# EAGLE design clock_kit (EAGLE 5.11)
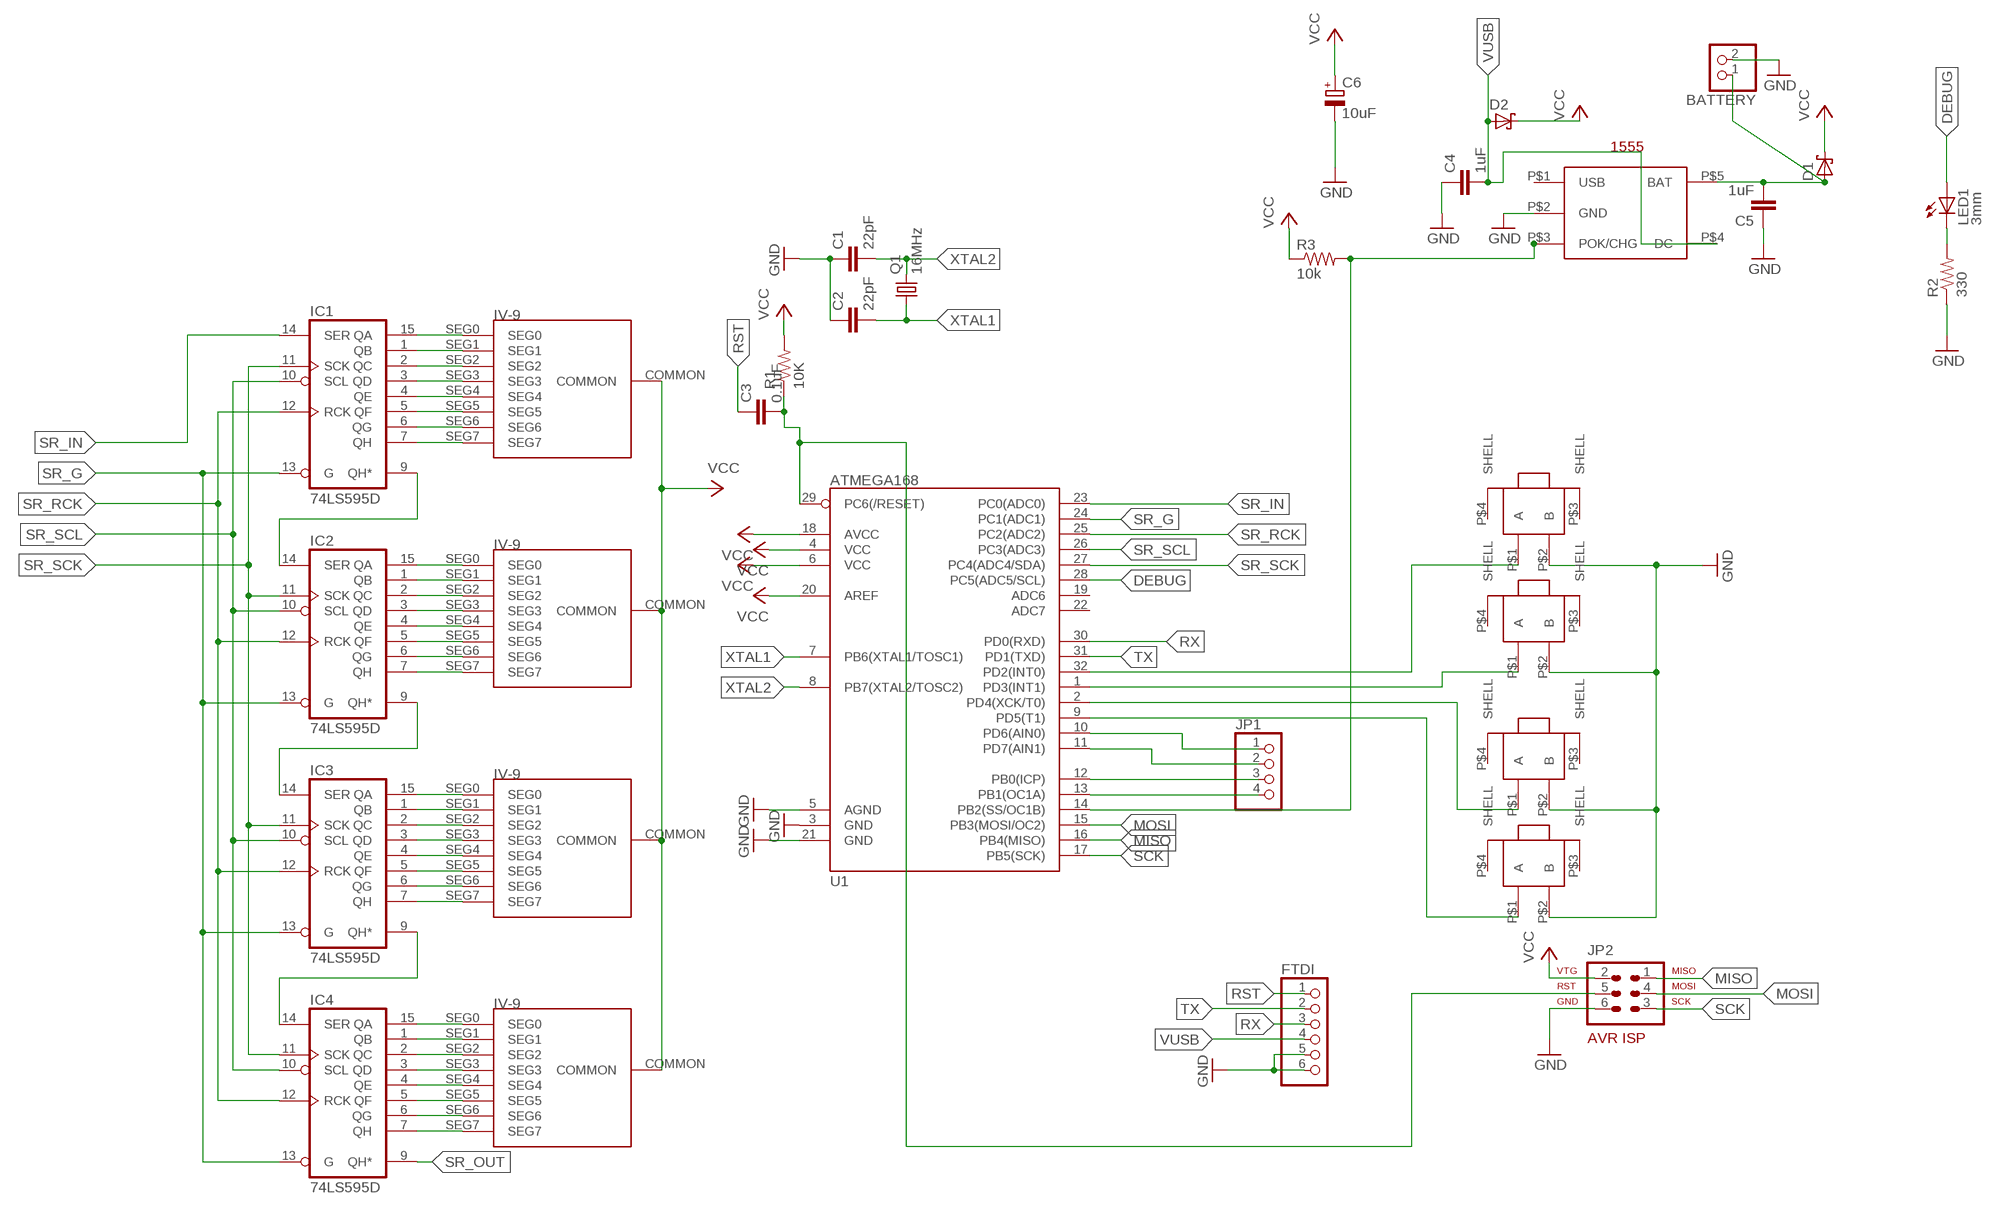
[diagram p0: schematic, sheet 1]

## Parts
BATTERY  PINHD-1X2  [1X02]
C1  22pF  C-EUC1206  [C1206]
C2  22pF  C-EUC1206  [C1206]
C3  0.1uF  C-EUC1206  [C1206]
C4  1uF  C-EUC1206  [C1206]
C5  1uF  C-EUC1206  [C1206]
C6  10uF  CPOL-EUE/7260-38W  [E/7260-38W]
D1  SCHOTTKY-DIODESMD  [SMB]
D2  SCHOTTKY-DIODESMD  [SMB]
FTDI  PINHEAD_PINHD-1X6  [PINHEAD_1X06]
IC1  74LS595D  [SO16]
IC2  74LS595D  [SO16]
IC3  74LS595D  [SO16]
IC4  74LS595D  [SO16]
JP1  PINHD-1X4  [1X04]
JP2  AVR-ISP-6  [AVR-ISP-6]
LED1  3mm  LEDCHIPLED_0805  [CHIPLED_0805]
Q1  16MHz  CRYSTALHC49S  [HC49/S]
R1  10K  R-US_R1206  [R1206]
R2  330  R-US_M1206  [M1206]
R3  10k  R-US_M1206  [M1206]
U1  ATMEGA168  [TQFP32-08]
U$1  DISPLAY_TUBES_IV-9MODIFIED  [DISPLAY_TUBES_IV-9_MODIFIED]
U$2  DISPLAY_TUBES_IV-9MODIFIED  [DISPLAY_TUBES_IV-9_MODIFIED]
U$3  DISPLAY_TUBES_IV-9MODIFIED  [DISPLAY_TUBES_IV-9_MODIFIED]
U$4  MAX1555  [SOT23-5]
U$5  DISPLAY_TUBES_IV-9MODIFIED  [DISPLAY_TUBES_IV-9_MODIFIED]
U$6  SWITCH_TACT_THRUHOLETHRUHOLE  [TACT_SWITCH_THRU_HOLE]
U$7  SWITCH_TACT_THRUHOLETHRUHOLE  [TACT_SWITCH_THRU_HOLE]
U$8  SWITCH_TACT_THRUHOLETHRUHOLE  [TACT_SWITCH_THRU_HOLE]
U$9  SWITCH_TACT_THRUHOLETHRUHOLE  [TACT_SWITCH_THRU_HOLE]

## Nets
DEBUG: LED1.A U1.28(PC5(ADC5/SCL))
GND [power]: BATTERY.2 C1.1 C2.1 C4.1 C5.1 C6.- FTDI.5 FTDI.6 JP2.6 R2.1 U1.3(GND) U1.5(AGND) U1.21(GND) U$4.P$2(GND) U$6.P$2(B) U$7.P$2(B) U$8.P$2(B) U$9.P$2(B)
MISO: JP2.1 U1.16(PB4(MISO))
MOSI: JP2.4 U1.15(PB3(MOSI/OC2))
N$1: IC1.15(QA) U$5.SEG0
N$2: IC1.1(QB) U$5.SEG1
N$3: IC1.2(QC) U$5.SEG2
N$4: IC1.3(QD) U$5.SEG3
N$5: IC1.4(QE) U$5.SEG4
N$6: IC1.5(QF) U$5.SEG5
N$7: IC1.6(QG) U$5.SEG6
N$8: IC1.7(QH) U$5.SEG7
N$9: IC2.15(QA) U$1.SEG0
N$10: IC2.1(QB) U$1.SEG1
N$11: IC2.2(QC) U$1.SEG2
N$12: IC2.3(QD) U$1.SEG3
N$13: IC2.4(QE) U$1.SEG4
N$14: IC2.5(QF) U$1.SEG5
N$15: IC2.6(QG) U$1.SEG6
N$16: IC2.7(QH) U$1.SEG7
N$17: IC3.15(QA) U$2.SEG0
N$18: IC3.1(QB) U$2.SEG1
N$19: IC3.2(QC) U$2.SEG2
N$20: IC3.3(QD) U$2.SEG3
N$21: IC3.4(QE) U$2.SEG4
N$22: IC3.5(QF) U$2.SEG5
N$23: IC3.6(QG) U$2.SEG6
N$24: IC3.7(QH) U$2.SEG7
N$25: IC4.15(QA) U$3.SEG0
N$26: IC4.1(QB) U$3.SEG1
N$27: IC4.2(QC) U$3.SEG2
N$28: IC4.3(QD) U$3.SEG3
N$29: IC4.4(QE) U$3.SEG4
N$30: IC4.5(QF) U$3.SEG5
N$31: IC4.6(QG) U$3.SEG6
N$32: IC4.7(QH) U$3.SEG7
N$33: IC1.9(QH*) IC2.14(SER)
N$34: IC2.9(QH*) IC3.14(SER)
N$35: IC3.9(QH*) IC4.14(SER)
N$36: R3.2 U1.14(PB2(SS/OC1B)) U$4.P$3(POK/CHG)
N$39: LED1.C R2.2
N$40: C3.2 JP2.5 R1.1 U1.29(PC6(/RESET))
N$41: U1.32(PD2(INT0)) U$6.P$1(A)
N$42: U1.1(PD3(INT1)) U$7.P$1(A)
N$43: U1.2(PD4(XCK/T0)) U$8.P$1(A)
N$44: U1.9(PD5(T1)) U$9.P$1(A)
N$45: BATTERY.1 C5.2 D1.A U$4.P$5(BAT)
N$46: JP1.4 U1.13(PB1(OC1A))
N$47: JP1.3 U1.12(PB0(ICP))
N$48: JP1.2 U1.11(PD7(AIN1))
N$49: JP1.1 U1.10(PD6(AIN0))
RST: C3.1 FTDI.1
RX: FTDI.3 U1.30(PD0(RXD))
SCK: JP2.3 U1.17(PB5(SCK))
SR_G: IC1.13(G) IC2.13(G) IC3.13(G) IC4.13(G) U1.24(PC1(ADC1))
SR_IN: IC1.14(SER) U1.23(PC0(ADC0))
SR_OUT: IC4.9(QH*)
SR_RCK: IC1.12(RCK) IC2.12(RCK) IC3.12(RCK) IC4.12(RCK) U1.25(PC2(ADC2))
SR_SCK: IC1.11(SCK) IC2.11(SCK) IC3.11(SCK) IC4.11(SCK) U1.27(PC4(ADC4/SDA))
SR_SCL: IC1.10(SCL) IC2.10(SCL) IC3.10(SCL) IC4.10(SCL) U1.26(PC3(ADC3))
TX: FTDI.2 U1.31(PD1(TXD))
VCC [power]: C6.+ D1.C D2.C JP2.2 R1.2 R3.1 U1.4(VCC) U1.6(VCC) U1.18(AVCC) U1.20(AREF) U$1.COMMON U$2.COMMON U$3.COMMON U$5.COMMON
VUSB: C4.2 D2.A FTDI.4 U$4.P$4(DC)
XTAL1: C2.2 Q1.1 U1.7(PB6(XTAL1/TOSC1))
XTAL2: C1.2 Q1.2 U1.8(PB7(XTAL2/TOSC2))
Unconnected: U1.19(ADC6) U1.22(ADC7) U$4.P$1(USB) U$6.P$3(SHELL) U$6.P$4(SHELL) U$7.P$3(SHELL) U$7.P$4(SHELL) U$8.P$3(SHELL) U$8.P$4(SHELL) U$9.P$3(SHELL) U$9.P$4(SHELL)

## Power pins joined to a net without a drawn wire
GND: IC1.8(GND) IC2.8(GND) IC3.8(GND) IC4.8(GND)
VCC: IC1.16(VCC) IC2.16(VCC) IC3.16(VCC) IC4.16(VCC)

## Library data of the parts
BATTERY = pinhead:PINHD-1X2: PIN HEADER
C1-C5 = rcl:C-EU: CAPACITOR, European symbol
C6 = rcl:CPOL-EU: POLARIZED CAPACITOR, European symbol
D1 D2 = diode:SCHOTTKY-DIODE: Schottky Diode
FTDI = clock_kit:PINHEAD_PINHD-1X6: PIN HEADER
IC1-IC4 = 74xx-us:74*595: 8-bit SHIFT REGISTER, output latch
JP1 = pinhead:PINHD-1X4: PIN HEADER
JP2 = avr-6:AVR-ISP-6: AVR ISP-6 Serial Programming Header
LED1 = led:LED: LED OSRAM: - CHIPLED LG R971, LG N971, LY N971, LG Q971, LY Q971, LO R971, LY R971 LH N974, LH R974 LS Q976, LO Q976, LY Q976 LO Q996 - Hyper CHIPLED LW Q18S LB Q993, LB Q99A, LB R99A - SideLED LS A670, LO A670, LY A670, LG A670, LP A670 LB A673, LV A673, LT A673, LW A673 LH A674 LY A675 LS A676, LA A676, LO A676, LY A676, LW A676 LS A679, LY A679, LG A679 - Hyper Micro SIDELED® LS Y876, LA Y876, LO Y876, LY Y876 LT Y87S - SmartLED LW L88C, LW L88S LB L89C, LB L89S, LG L890 LS L89K, LO L89K, LY L89K LS L896, LA L896, LO L896, LY L896 - TOPLED LS T670, LO T670, LY T670, LG T670, LP T670 LSG T670, LSP T670, LSY T670, LOP T670, LYG T670 LG T671, LOG T671, LSG T671 LB T673, LV T673, LT T673, LW T673 LH T674 LS T676, LA T676, LO T676, LY T676, LB T676, LH T676, LSB T676, LW T676 LB T67C, LV T67C, LT T67C, LS T67K, LO T67K, LY T67K, LW E67C LS E67B, LA E67B, LO E67B, LY E67B, LB E67C, LV E67C, LT E67C LW T67C LS T679, LY T679, LG T679 LS T770, LO T770, LY T770, LG T770, LP T770 LB T773, LV T773, LT T773, LW T773 LH T774 LS E675, LA E675, LY E675, LS T675 LS T776, LA T776, LO T776, LY T776, LB T776 LHGB T686 LT T68C, LB T68C - Hyper Mini TOPLED® LB M676 - Mini TOPLED Santana® LG M470 LS M47K, LO M47K, LY M47K Source: http://www.osram.convergy.de LUXEON: - LUMILED® LXK2-PW12-R00, LXK2-PW12-S00, LXK2-PW14-U00, LXK2-PW14-V00 LXK2-PM12-R00, LXK2-PM12-S00, LXK2-PM14-U00 LXK2-PE12-Q00, LXK2-PE12-R00, LXK2-PE12-S00, LXK2-PE14-T00, LXK2-PE14-U00 LXK2-PB12-K00, LXK2-PB12-L00, LXK2-PB12-M00, LXK2-PB14-N00, LXK2-PB14-P00, LXK2-PB14-Q00 LXK2-PR12-L00, LXK2-PR12-M00, LXK2-PR14-Q00, LXK2-PR14-R00 LXK2-PD12-Q00, LXK2-PD12-R00, LXK2-PD12-S00 LXK2-PH12-R00, LXK2-PH12-S00 LXK2-PL12-P00, LXK2-PL12-Q00, LXK2-PL12-R00 Source: www.luxeon.com KINGBRIGHT: KA-3528ASYC Source: www.kingbright.com
Q1 = crystal:CRYSTAL: CRYSTAL
R1-R3 = rcl:R-US_: RESISTOR, American symbol
U1 = SparkFun2011:ATMEGA168
U$1-U$3 U$5 = clock_kit:DISPLAY_TUBES_IV-9
U$4 = RaphaelBigLibrary:MAX1555
U$6-U$9 = clock_kit:SWITCH_TACT_THRUHOLE

## Net classes
0 default: width 0.254 mm, drill 0.508 mm, clearance 0.178 mm
1 power: width 0.508 mm, drill 0.508 mm, clearance 0.178 mm

## Board
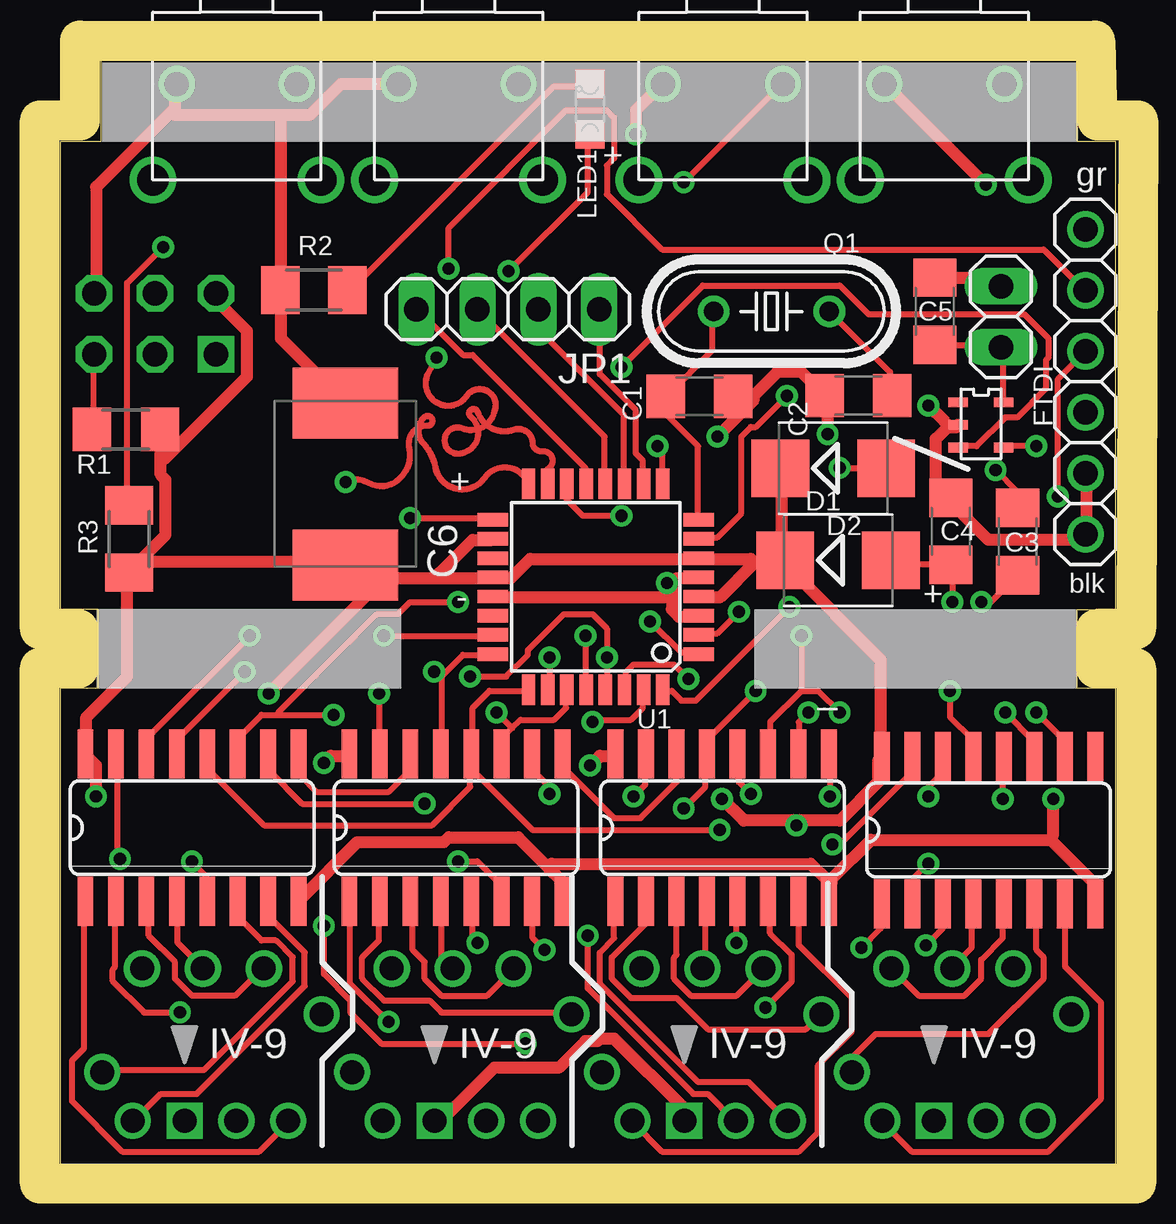
[diagram p1: board, top side]
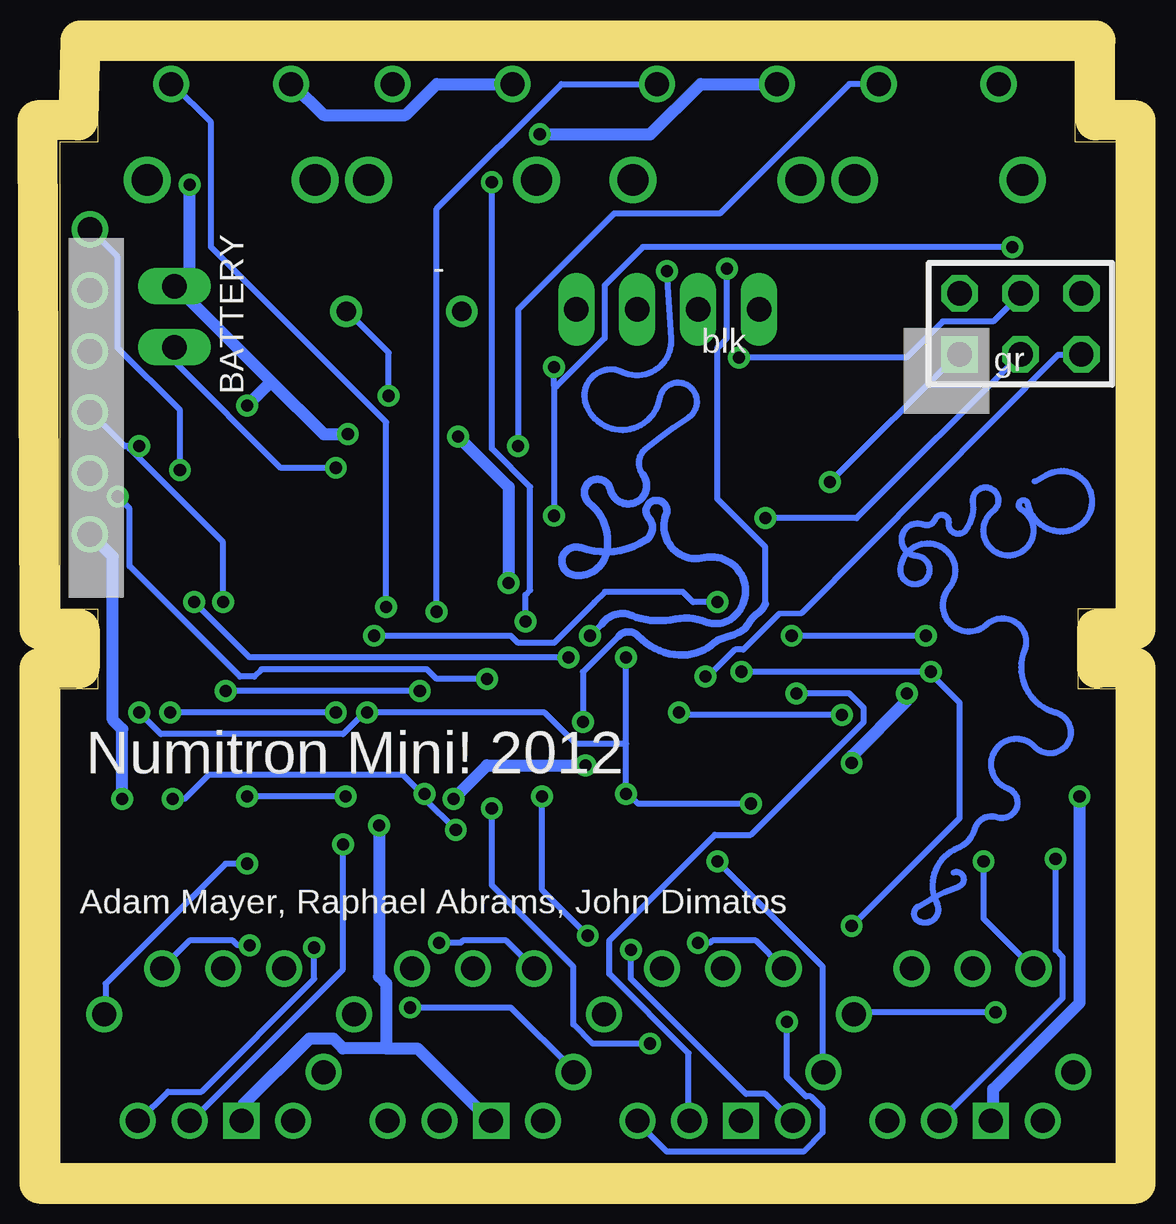
[diagram p2: board, bottom side, seen from below]

Size 44 x 46 mm. Coordinates in mm from the lower left corner, seen from the top.
Outline: 0,0 44,0 44,19.8 42.4,19.8 42.4,23.1 44,23.1 44,42.6 42.4,42.6 42.4,46 1.7,46 1.7,42.6 0,42.6 0,23.11 1.57,23.11 1.57,19.81 0,19.81 0,0
Copper layers (1*16): Top 0.035mm / dielectric 1.5mm / Bottom 0.035mm
Design rules "default *": minimum track width 7mil, minimum drill 20mil, track to track 9mil, track to pad 9mil, pad to pad 9mil, via to via 9mil, smd to smd 0mil, copper to edge 10mil, drill to drill 8mil, minimum pad ring 10mil, minimum via ring 8mil, stop-mask expansion 2mil, vias tented up to drill 0mil, thermal gap 10mil
Milling: 16 lines

### Footprints (pad centres in the part's own frame; a part is rotated, then mirrored left to right if it is on the bottom)
1X02 = drill 1.016 long: 1 -1.27,0; 2 1.27,0
C1206 = smd 1.6 x 1.8: 1 -1.4,0; 2 1.4,0
E/7260-38W = smd 2.95 x 4.4: + 3.375,0; - -3.375,0
SMB = smd 2.4 x 2.4: A 2.2,0; C -2.2,0
PINHEAD_1X06 = drill 1.016 round: 1 -6.35,0; 2 -3.81,0; 3 -1.27,0; 4 1.27,0; 5 3.81,0; 6 6.35,0
SO16 = smd 0.66 x 2.032: 1 -4.445,-3.073; 2 -3.175,-3.073; 3 -1.905,-3.073; 4 -0.635,-3.073; 5 0.635,-3.073; 6 1.905,-3.073; 7 3.175,-3.073; 8 4.445,-3.073; 9 4.445,3.073; 10 3.175,3.073; 11 1.905,3.073; 12 0.635,3.073; 13 -0.635,3.073; 14 -1.905,3.073; 15 -3.175,3.073; 16 -4.445,3.073
1X04 = drill 1.016 long: 1 -3.81,0; 2 -1.27,0; 3 1.27,0; 4 3.81,0
AVR-ISP-6 = drill 1.016 square: 1 -2.54,-1.27 | drill 1.016 octagon: 2 -2.54,1.27; 3 0,-1.27; 4 0,1.27; 5 2.54,-1.27; 6 2.54,1.27
CHIPLED_0805 = smd 1.2 x 1.2: A 0,-1.05; C 0,1.05
HC49/S = drill 0.813 round: 1 -2.413,0; 2 2.413,0
R1206 = smd 1.6 x 1.803: 1 -1.422,0; 2 1.422,0
M1206 = smd 1.6 x 2: 1 -1.4,0; 2 1.4,0
TQFP32-08 = smd 1.27 x 0.559: 1 -4.293,2.8; 2 -4.293,2; 3 -4.293,1.2; 4 -4.293,0.4; 5 -4.293,-0.4; 6 -4.293,-1.2; 7 -4.293,-2; 8 -4.293,-2.8; 17 4.293,-2.8; 18 4.293,-2; 19 4.293,-1.2; 20 4.293,-0.4; 21 4.293,0.4; 22 4.293,1.2; 23 4.293,2; 24 4.293,2.8 | smd 0.559 x 1.27: 9 -2.8,-4.293; 10 -2,-4.293; 11 -1.2,-4.293; 12 -0.4,-4.293; 13 0.4,-4.293; 14 1.2,-4.293; 15 2,-4.293; 16 2.8,-4.293; 25 2.8,4.293; 26 2,4.293; 27 1.2,4.293; 28 0.4,4.293; 29 -0.4,4.293; 30 -1.2,4.293; 31 -2,4.293; 32 -2.8,4.293
DISPLAY_TUBES_IV-9_MODIFIED = drill 1 square: COMMON -1.397,-3.81 | drill 1 round: SEG0 0.762,-3.81; SEG1 2.921,-3.81; SEG2 4.318,0.635; SEG3 1.905,2.54; SEG4 -0.635,2.54; SEG5 -3.175,2.54; SEG6 -4.826,-1.778; SEG7 -3.556,-3.81
SOT23-5 = smd 0.813 x 0.406: P$1 -0.127,-0.559; P$2 -0.127,-1.499; P$3 -0.127,-2.438; P$4 1.753,-2.438; P$5 1.753,-0.559
TACT_SWITCH_THRU_HOLE = drill 1 round: P$1 -2,0; P$2 3,0 | drill 1.3 round: P$3 4,4; P$4 -3,4

### Placement (x,y rotation side)
BATTERY  39.22,35.29 90 top
C1  26.66,31.98 180 top
C2  33.28,32.01 0 top
C3  39.92,25.93 270 top
C4  37.14,26.36 270 top
C5  36.47,35.53 270 top
C6  11.9,28.33 270 top
D1  32.23,28.98 0 top
D2  32.44,25.15 0 top
FTDI  42.74,32.59 270 top
IC1  5.51,14 0 top
IC2  16.51,14 0 top
IC3  27.61,14 0 top
IC4  38.71,13.9 0 top
JP1  18.67,35.61 180 top
JP2  3.97,35 0 bottom
LED1  22.09,43.95 0 top
Q1  29.66,35.52 180 top
R1  2.75,30.6 0 top
R2  10.58,36.41 0 top
R3  2.88,26.04 90 top
U1  22.33,24.04 180 top
U$1  17.01,5.59 0 top
U$2  27.42,5.59 0 top
U$3  37.83,5.59 0 top
U$4  37.57,32.29 0 top
U$5  6.59,5.59 0 top
U$6  37.36,45 180 top
U$7  28.14,45 180 top
U$8  17.12,45 180 top
U$9  7.87,45 180 top

### Tracks (layer width: path | path; a pad name or v marks a point on that pad's centre or on a via)
DEBUG  (via drill 0.51)
  Top 0.254: v18.7,37.2 22,40.5 22,42.8 LED1.A | v21.9,22 21.9,19.8 U1.28
  Bottom 0.254: 21.4,22.5 v21.9,22 | v18.7,37.2 18.52,34.38 arc119 20.56,33 arc-133 22.08,31.68 arc-153 19.01,31.89 arc227 17.8,31.1 arc-5 19.56,29.82 arc-88 19.7,28.71
  Bottom 0.305: 19.7,28.71 arc204 21.05,28.09 arc-219 21.94,27.54 arc67 21.25,25.36 arc85 22.6,24.53 arc188 22.29,25.67 arc-52 19.59,25.98 arc-99 19.46,26.92 arc243 18.73,27.05 arc-126 17.14,25.26 arc163 16.17,22.61 arc50 17.24,22.63 arc-29 18.35,22.7 arc12 19.18,22.63 arc22 20.15,22.84 arc-77 21.4,22.5
GND  (via drill 0.51)
  Top 0.508: 20.35,12.35 20.9,11.8 20.9,11 IC2.8 | 20.35,12.35 19.1,13.6 16.2,13.6 16,13.4 12.4,13.4 10,11 IC1.8 | 20.35,12.35 20.5,12.5 31.3,12.5 32,11.8 32,11 IC3.8 32.2,11.9 33.8,13.5 41.3,13.5 | 41.3,13.5 43.1,11.7 43.1,10.9 IC4.8 | C6.- 11.8,31.8 9.2,34.4 9.2,36.4 R2.1 9.2,36.6 9.2,43.7 | 4.65,43.85 1.5,40.7 1.5,36.3 JP2.6 | 4.65,43.85 4.8,44 4.8,45 U$9.P$2 | 9.2,43.7 4.8,43.7 4.65,43.85 | 9.2,43.7 10.4,43.7 11.7,45 U$8.P$2 | 37,30.7 37.4,30.7 U$4.P$2 | 37,30.7 36.5,30.2 36.5,28.4 37.1,27.8 C4.1 37.2,27.5 38.7,26 42.5,26 42.7,26.2 FTDI.6 42.8,26.4 42.8,28.7 FTDI.5 | 25.5,24.2 25.5,23.6 | 25.5,23.6 25.5,23.1 25.8,22.8 26.6,22.8 U1.3 | 25.5,24.2 25.7,24.4 26.6,24.4 U1.5 | U1.21 18.1,23.6 25.5,23.6 | 28.9,32 28.1,32 C1.1 | 28.9,32 29.9,33 30.9,33 31.8,32.1 C2.1 32,31.8 v32,30.4 | C5.1 36.5,36.9 38.9,36.9 39.2,36.6 BATTERY.2 | v27.4,30.3 28.9,31.8 28.9,32 | v25.3,24.2 25.5,24.2 | v36.2,31.6 36.9,30.9 37,30.7 | v38.6,40.8 34.4,45 U$6.P$2 | v24,42.9 24,43.9 25.1,45 U$7.P$2 | v41.4,15.2 41.4,13.7 41.3,13.5
  Bottom 0.508: U$7.P$2 28.3,45 29.6,43.7 33,43.7 34.3,45 U$6.P$2 | v32,30.4 33,30.4 35.2,32.6 | 35.2,32.6 39.2,36.6 BATTERY.2 38.6,36.3 v38.6,40.8 | v25.3,24.2 25.3,28.2 v27.4,30.3 | v36.2,31.6 35.2,32.6 | v24,42.9 19.4,42.9 17.3,45 U$8.P$2 | v41.4,15.2 41.4,18.1 41.8,18.5 41.8,25.3 42.7,26.2 FTDI.6
MISO  (via drill 0.51)
  Top 0.254: U1.16 19.5,28.4 arc120 17.69,28.57 arc-135 15.66,29.02 arc33 15.17,29.99 arc-87 15.17,31.1 arc-230 15.31,30.75 arc106 14.55,29.85 arc-64 14.07,28.47 arc-68 12.86,28.37 arc55 v11.9,28.4
  Bottom 0.254: v11.9,28.4 6.6,33.7 JP2.1
MOSI  (via drill 0.51)
  Top 0.254: U1.15 20.3,28.4 20.31,28.94 arc161 20.1,29.69 arc-95 19.7,30.04 arc108 18.91,30.59 arc-91 17.41,31.33 arc212 17.12,31.13 arc-138 16.62,29.59 arc-60 16.12,29.84 arc-146 16.77,30.64 arc102 18.11,31.38 arc160 17,32.06 arc-170 15.3,32.86 v15.7,33.6
  Bottom 0.254: v15.7,33.6 8.7,33.6 7.2,35.1 5.1,35.1 4,36.2 JP2.4
N$1  (via drill 0.51)
  Top 0.254: v2.5,12.7 2.4,12.8 2.4,17 IC1.15
  Bottom 0.254: v2.5,12.7 2.5,8.9 2.2,8.6 2.2,6.9 7.3,1.8 U$5.SEG0
N$2
  Top 0.254: IC1.1 1,10.9 1,4.8 0.5,4.3 0.5,2.6 2.6,0.5 8.3,0.5 9.5,1.7 U$5.SEG1
N$3  (via drill 0.51)
  Top 0.254: v5,6.3 3.5,6.3 2.2,7.6 2.2,8.1 2.3,8.2 2.3,10.9 IC1.2
  Bottom 0.254: v5,6.3 10.9,6.3 U$5.SEG2
N$4
  Top 0.254: IC1.3 3.7,10.9 3.7,9.5 4.8,8.4 4.8,7.7 5.5,7 7.3,7 8.4,8.1 U$5.SEG3
N$5
  Top 0.254: IC1.4 4.9,10.9 4.9,9.2 5.9,8.2 U$5.SEG4
N$6  (via drill 0.51)
  Top 0.254: v5.5,12.6 6.1,12 6.1,11 IC1.5
  Bottom 0.254: v5.5,12.6 5.5,10.2 3.5,8.2 U$5.SEG5
N$7
  Top 0.254: IC1.6 7.5,10.9 7.5,10.2 8.4,9.3 9,9.3 9.7,8.6 9.7,7.6 6,3.9 1.8,3.9 U$5.SEG6
N$8
  Top 0.254: IC1.7 8.7,10.9 8.7,10.3 10.2,8.8 10.2,7.4 5.7,2.9 4.2,2.9 3.1,1.8 U$5.SEG7
N$9  (via drill 0.51)
  Top 0.254: v13.3,19.6 13.3,17.1 IC2.15
  Bottom 0.254: v13.3,19.6 11.1,19.6 10.5,19 10.5,18.4 15.2,13.7 16.7,13.7 21.1,9.3 21.1,7.9 17.8,4.6 17.8,1.8 U$1.SEG0
N$10  (via drill 0.51)
  Top 0.254: v13.7,5.9 12.1,7.5 12.1,10.9 IC2.1
  Bottom 0.254: v13.7,5.9 13.7,3.6 12.9,2.8 12.7,2.8 12.2,2.3 12.2,1.3 13,0.5 18.7,0.5 19.9,1.7 U$1.SEG1
N$11
  Top 0.254: IC2.2 13.3,10.9 13.3,9.3 12.6,8.6 12.6,7.7 13.5,6.8 15.4,6.8 15.9,6.3 21.3,6.3 U$1.SEG2
N$12
  Top 0.254: IC2.3 14.7,10.9 14.7,8.9 15.2,8.4 15.2,7.7 15.9,7 17.8,7 18.9,8.1 U$1.SEG3
N$13
  Top 0.254: IC2.4 15.9,10.9 15.9,8.6 16.3,8.2 U$1.SEG4
N$14  (via drill 0.51)
  Top 0.254: v17.4,9.2 17.2,9.4 17.2,10.9 IC2.5
  Bottom 0.254: v17.4,9.2 16.9,9.2 16.8,9.3 15,9.3 13.9,8.2 U$1.SEG5
N$15  (via drill 0.51)
  Top 0.254: v16.6,12.6 17.4,12.6 18.4,11.6 18.4,11 IC2.6
  Bottom 0.254: v16.6,12.6 12.2,8.2 12.2,3.9 U$1.SEG6
N$16  (via drill 0.51)
  Top 0.254: v20.2,8.9 19.7,9.4 19.7,10.9 IC2.7
  Bottom 0.254: v20.2,8.9 20.2,7.7 15.4,2.9 14.6,2.9 13.5,1.8 U$1.SEG7
N$17  (via drill 0.51)
  Top 0.254: v23.9,15.3 24.4,15.8 24.4,17 IC3.15 | v22,9.5 22,7.3 26.4,2.9 27,2.9 28.1,1.8 U$2.SEG0
  Bottom 0.254: v23.9,15.3 23.9,11.4 v22,9.5
N$18
  Top 0.254: IC3.1 23.1,10.9 23.1,9.4 22.5,8.8 22.5,7.5 26.6,3.4 28.7,3.4 30.3,1.8 U$2.SEG1
N$19
  Top 0.254: IC3.2 24.4,10.9 24.4,10 23,8.6 23,7.7 23.8,6.9 25.7,6.9 27,5.6 31.1,5.6 31.7,6.2 U$2.SEG2
N$20
  Top 0.254: IC3.3 25.7,10.9 25.7,8.7 25.6,8.6 25.6,7.7 26.3,7 28.2,7 29.3,8.1 U$2.SEG3
N$21
  Top 0.254: IC3.4 26.9,10.9 26.9,8.3 26.8,8.2 U$2.SEG4
N$22  (via drill 0.51)
  Top 0.254: v28.2,9.2 28.2,10.9 IC3.5
  Bottom 0.254: v28.2,9.2 27.3,9.2 27.2,9.3 25.4,9.3 24.3,8.2 U$2.SEG5
N$23  (via drill 0.51)
  Top 0.254: v29.4,6.5 30.5,7.6 30.5,8.7 29.6,9.6 29.6,10.9 IC3.6
  Bottom 0.254: v29.4,6.5 25.2,6.5 22.6,3.9 U$2.SEG6
N$24
  Top 0.254: IC3.7 30.8,10.9 30.8,9.1 33,6.9 33,5.5 31.6,4.1 31.6,1.3 30.8,0.5 25.1,0.5 23.9,1.7 U$2.SEG7
N$25  (via drill 0.51)
  Top 0.254: v32.2,13.3 32.5,13.3 35.5,16.3 35.5,16.9 IC4.15
  Bottom 0.254: v32.2,13.3 32.2,8.1 38.5,1.8 U$3.SEG0
N$26  (via drill 0.51)
  Top 0.254: v33.4,9 34.2,9.8 34.2,10.8 IC4.1
  Bottom 0.254: v33.4,9 33.4,7.7 38.1,3 39.5,3 40.7,1.8 U$3.SEG1
N$27  (via drill 0.51)
  Top 0.254: v36.2,12.5 35.6,11.9 35.6,10.9 IC4.2
  Bottom 0.254: v36.2,12.5 37.1,12.5 42.1,7.5 42.1,6.3 U$3.SEG2
N$28  (via drill 0.51)
  Top 0.254: v36.1,9.1 36.8,9.8 36.8,10.8 IC4.3
  Bottom 0.254: v36.1,9.1 36.6,9.1 36.8,9.3 38.6,9.3 39.7,8.2 U$3.SEG3
N$29
  Top 0.254: IC4.4 38,10.8 38,9 37.2,8.2 U$3.SEG4
N$30
  Top 0.254: IC4.5 39.3,10.8 39.3,9.4 38.4,8.5 38.4,7.7 37.7,7 35.8,7 34.7,8.1 U$3.SEG5
N$31
  Top 0.254: IC4.6 40.7,10.8 40.7,8.9 41,8.6 41,7.7 38.7,5.4 34,5.4 33.1,4.5 33.1,3.9 U$3.SEG6
N$32
  Top 0.254: IC4.7 41.9,10.8 41.9,8.2 43.4,6.7 43.4,2.7 41.2,0.5 35.5,0.5 34.3,1.7 U$3.SEG7
N$33
  Top 0.254: IC1.9 10,17 10,16.2 10.7,15.5 13.7,15.5 14.6,16.4 14.6,17 IC2.14
N$34
  Top 0.254: IC2.9 21,17 21,16.5 23.1,14.4 24.2,14.4 25.7,15.9 25.7,17 IC3.14
N$35  (via drill 0.51)
  Top 0.254: v32.1,15.3 32.1,17 IC3.9 | v36.2,15.3 36.2,15.7 36.8,16.3 36.8,16.9 IC4.14
  Bottom 0.254: v32.1,15.3 v36.2,15.3
N$36  (via drill 0.51)
  Top 0.254: v23.4,33.2 26.8,36.6 32.5,36.6 33.7,35.4 40.2,35.4 41.2,34.4 41.2,33.6 41.1,33.5 41.1,32.3 39.9,31.1 39.4,31.1 38.2,29.9 37.5,29.9 U$4.P$3 | v23.4,27 21.8,27 21.1,27.7 21.1,28.3 U1.14 | v4.3,38.2 2.8,36.7 2.8,27.5 R3.2
  Bottom 0.254: 23.4,32.4 v23.4,27 | 23.4,32.4 v23.4,33.2 | v4.3,38.2 19.7,38.2 21.3,36.6 21.3,34.4 23.3,32.4 23.4,32.4
N$37
  Bottom 0.254: 3.37,28.43 2.87,28.71 arc218 2.44,26.35 arc69 3.65,27.49 arc-228 3.94,27.28 arc293 5.09,27.21 arc-240 5.95,27.57 arc42 6.23,26.42 arc153 6.95,26.7 arc-166 7.52,26.85 arc89 8.02,26.63 arc-196 8.31,25.34 arc268 8.96,24.77 arc217 6.95,23.98 arc-173 5.37,22.47 arc154 3.8,21.39 arc-97 2.51,18.81 arc211 3.37,17.37 arc-206 4.51,15.65 arc178 4.94,14.43 arc-93 5.88,13.93 arc52 6.59,13.14 arc-95 7.45,10.84 arc150 8.24,10.12 arc115 8.24,10.7 arc12 6.52,11.56 arc-181 6.74,12.13
N$39
  Top 0.254: LED1.C 22,44.9 20.6,44.9 12.2,36.5 12,36.5 R2.2
N$40  (via drill 0.51)
  Top 0.254: R1.1 1.4,30.7 1.4,33.7 JP2.5 | v38.4,23.4 38.8,23.4 39.9,24.5 C3.2 | U1.29 22.8,19.8 v22.8,21.1 22.8,22.3 22.2,22.9 21,22.9 19.5,21.4 19.5,21.2 18.6,20.3 v17.1,20.3
  Bottom 0.254: v22.8,21.1 36.1,21.1 v38.4,23.4 | v17.1,20.3 16.98,20.3 15.86,21.42 15.52,21.42 14.03,22.91 13.11,22.93 13.06,22.96 2.4,33.7 1.5,33.7 JP2.5
N$41  (via drill 0.51)
  Top 0.254: v30.4,23.2 26.5,19.3 25.9,19.3 25.5,19.7 25.2,19.7 U1.32
  Bottom 0.254: v30.4,23.2 30.4,30.9 37.7,38.2 37.7,43.4 39.3,45 U$6.P$1
N$42  (via drill 0.51)
  Top 0.254: v24.6,22.6 25.9,21.3 26.6,21.3 U1.1 | v26,40.9 30.1,45 U$7.P$1
  Bottom 0.254: v24.6,22.6 24.6,23.7 24.4,23.9 24.4,28.2 26,29.8 v26,40.9
N$43  (via drill 0.51)
  Top 0.254: v28.3,23 27.4,22.1 26.7,22.1 U1.2
  Bottom 0.254: v28.3,23 28.3,39.8 23.1,45 U$8.P$1
N$44  (via drill 0.51)
  Top 0.254: v24.9,29.9 25.1,29.7 25.1,28.4 U1.9
  Bottom 0.254: v24.9,29.9 24.9,35.6 20.9,39.6 16.5,39.6 11.1,45 U$9.P$1
N$45  (via drill 0.51)
  Top 0.254: U$4.P$5 39.3,31.8 39.3,34 BATTERY.1 39.2,34.1 36.5,34.1 C5.2 | v32.5,29 34.4,29 D1.A
  Bottom 0.254: v32.5,29 34.8,29 39.2,33.4 39.2,34 BATTERY.1
N$46
  Top 0.254: U1.13 21.9,28.4 21.9,29 17.2,33.7 16.8,33.7 14.9,35.6 JP1.4
N$47
  Top 0.254: U1.12 22.7,28.4 22.7,30.3 JP1.3
N$48
  Top 0.254: U1.11 23.5,28.4 23.5,31.2 20,34.7 20,35.6 JP1.2
N$49
  Top 0.254: U1.10 24.3,28.4 24.3,29.3 24,29.6 24,31.4 22.5,32.9 22.5,35.6 JP1.1
RST  (via drill 0.51)
  Top 0.254: v39,28.9 39.9,28 39.9,27.4 C3.1
  Bottom 0.254: v39,28.9 39,31.4 41.6,34 41.6,37.8 42.7,38.9 FTDI.1
RX  (via drill 0.51)
  Top 0.254: v26.2,20.2 25.6,20.8 23.9,20.8 23.6,20.5 23.6,19.8 U1.30 | v41.6,27.8 41.6,32.7 42.7,33.8 FTDI.3
  Bottom 0.254: v26.2,20.2 28.3,20.2 28.7,20.6 35.6,20.6 35.9,20.3 36.5,20.3 41.1,24.9 41.1,27.3 v41.6,27.8
SCK  (via drill 0.51)
  Top 0.254: v14.6,26.9 18,26.9 U1.17
  Bottom 0.254: v14.6,26.9 10.8,26.9 4,33.7 JP2.3
SR_G  (via drill 0.51)
  Top 0.254: v29,19.7 27,17.7 27,17.1 IC3.13 26.9,17 26.9,15.7 v26,14.8 | v37.1,19.7 37.1,18.6 38,17.7 38,17 IC4.13 | 15.9,20.3 16.8,21.2 18,21.2 U1.24 | 15.9,20.3 15.9,17.1 IC2.13 | v7.7,20.5 4.9,17.7 4.9,17.1 IC1.13 | v15.6,20.5 15.8,20.3 15.9,20.3 | v19.4,5 13.4,5 12.1,6.3 12.1,6.8 11,7.9 v11,9.9
  Bottom 0.254: v29,19.7 v37.1,19.7 | v15.6,20.5 v7.7,20.5 7.7,20.4 6.5,19.2 6.5,14.4 v11,9.9 | v26,14.8 26,11.6 22.6,8.2 22.6,5.8 21.8,5 v19.4,5
SR_IN  (via drill 0.51)
  Top 0.254: v13.5,22 18,22 U1.23 | v7.9,22 3.7,17.8 3.7,17.1 IC1.14
  Bottom 0.254: v7.9,22 v13.5,22
SR_RCK  (via drill 0.51)
  Top 0.254: U1.25 19.5,19.7 17.9,19.7 17.2,19 17.2,17.1 IC2.12 | IC1.12 6.2,17 6.2,16.4 8.5,14.1 15.5,14.1 17.1,15.7 17.1,17 IC2.12 | v28.8,15.4 28.3,15.9 28.3,17 IC3.12 | v27.5,13.9 19.7,13.9 17.2,16.4 IC2.12 | v39.3,15.2 39.3,16.9 IC4.12
  Bottom 0.254: v27.5,13.9 28.8,15.2 v28.8,15.4 28.9,15.4 29.7,16.2 37.8,16.2 38.8,15.2 v39.3,15.2
SR_SCK  (via drill 0.51)
  Top 0.254: v39.4,18.8 40.6,17.6 40.6,17 IC4.11 | v32.5,18.8 31.6,19.7 30.9,19.7 | 30.9,19.7 29.6,18.4 29.6,17.1 IC3.11 | 18.85,18.15 18.5,17.8 18.5,17.1 IC2.11 | 18.85,18.15 19.2,18.5 20.6,18.5 21.1,19 21.1,19.7 U1.27 | 9.1,18.7 v11.4,18.7 | 9.1,18.7 8.4,18.7 7.5,17.8 7.5,17.1 IC1.11 | v18.2,18.8 18.85,18.15 | v16.6,23.4 14.6,23.4 14.1,22.9 13.2,22.9 9.1,18.8 9.1,18.7 | v30.9,22 30.9,19.7
  Bottom 0.254: v32.5,18.8 v39.4,18.8 | v11.4,18.7 18.1,18.7 v18.2,18.8 | v30.9,22 25.2,22 24.9,21.7 23.4,21.7 21.7,23.4 21.73,23.39 21.29,23.83 18.04,23.83 17.61,23.4 v16.6,23.4
SR_SCL  (via drill 0.51)
  Top 0.254: v20.4,21.1 20.4,19.8 U1.26 | v20.4,15.4 20.4,15.7 19.7,16.4 19.7,17 IC2.10 | v15.2,15 10.1,15 8.7,16.4 8.7,17 IC1.10 | v31.2,18.8 30.8,18.4 30.8,17.1 IC3.10 | v40.7,18.8 41.8,17.7 41.8,17 IC4.10
  Bottom 0.254: 20.4,17.5 v20.4,15.4 20.3,15.4 19.9,15 v15.2,15 | 20.4,17.5 v20.4,21.1 | 20.4,17.5 22.5,17.5 23.8,18.8 v31.2,18.8 31.3,18.8 32.2,17.9 39.8,17.9 v40.7,18.8
TX  (via drill 0.51)
  Top 0.254: v22.2,18.4 22.3,18.5 23.8,18.5 24.3,19 24.3,19.7 U1.31 | v16.2,37.3 16.2,39 21.1,43.9 22.8,43.9 23.1,43.6 23.1,41.9 22.8,41.6 22.8,40.4 25.1,38.1 41,38.1 42.7,36.4 FTDI.2
  Bottom 0.254: v22.2,18.4 22.2,20.5 20.7,22 | 14.6,23.33 14.6,25.7 16.6,27.7 16.6,34 16.2,34.4 v16.2,37.3
  Bottom 0.305: 20.7,22 arc91 19.9,21.99 arc-39 18.38,21.21 arc-49 16.72,21.71 arc26 16.39,21.89 arc-7 15.71,22.13 arc-38 15.3,22.5 arc25 14.93,22.92 arc-30 14.6,23.33
VCC  (via drill 0.51)
  Top 0.508: U$1.COMMON 15.7,1.8 15.9,1.8 18.1,4 20.8,4 21.9,5.1 22.4,5.1 22.5,5.2 23.1,5.2 26,2.3 26,1.8 U$2.COMMON | 28.95,25.05 29,25.1 30.2,25.1 D2.C | 28.95,25.05 27.5,23.6 26.7,23.6 U1.4 | 28.95,25.05 28.8,25.2 26.7,25.2 U1.6 26.4,25.2 19.6,25.2 18.8,24.4 18.2,24.4 U1.20 18,24.4 15.8,24.4 | D2.C 30.3,24.9 34.2,21 34.2,17 IC4.16 34.1,16.8 34.1,15.9 32.5,14.3 30.7,14.3 | v22.1,16.6 22.5,17 23.1,17 IC3.16 | v27.6,15.2 28.5,14.3 30.7,14.3 | D1.C 30.1,28.9 30.1,25.3 D2.C | 15.8,24.4 12.4,24.4 11.9,24.9 C6.+ | U1.18 18,26 17.2,26 15.8,24.6 15.8,24.4 | v11,16.7 11.3,17 12,17 IC2.16 | v8.7,19.6 13.3,24.2 C6.+ | 4.2,29.4 4.2,28.7 4.4,28.5 4.4,26.2 2.9,24.7 R3.1 | 4.2,29.4 4.2,30.6 R1.2 | R3.1 2.8,24.4 2.8,20.3 1.1,18.6 1.1,17.1 IC1.16 1.2,16.9 1.5,16.6 v1.5,15.3 | JP2.2 6.6,36.2 6.6,35.9 7.8,34.7 7.8,32.8 4.4,29.4 4.2,29.4 | C6.+ 11.7,25.1 3.6,25.1 R3.1 | 30.7,14.3 v30.7,14.1
  Bottom 0.508: 30.4,4.8 29.1,4.8 26.1,1.8 U$2.COMMON | 30.4,4.8 32.2,4.8 32.6,5.2 33.6,5.2 36.4,2.4 36.4,1.8 U$3.COMMON | v22.1,16.6 26.2,16.6 v27.6,15.2 | v11,16.7 11,17 8.7,19.3 v8.7,19.6 | v1.5,15.3 1.5,6.7 5.1,3.1 5.1,1.8 U$5.COMMON | v30.7,14.1 30.7,7.8 30.4,7.5 30.4,4.8
VUSB  (via drill 0.51)
  Top 0.254: D2.A 34.7,25.1 34.8,25 37.1,25 C4.2 37.2,24.9 v37.2,23.4 | v40.7,29.9 39.4,29.9 U$4.P$4
  Bottom 0.254: FTDI.4 42.7,31.3 41.3,29.9 v40.7,29.9 41.1,29.8 37.2,25.9 v37.2,23.4
XTAL1  (via drill 0.51)
  Top 0.254: v30.3,32 29,30.7 28.8,30.7 28.4,30.3 28.4,27.1 27.4,26.1 26.7,26.1 U1.7 | C2.2 34.6,32.1 34.6,33 32.1,35.5 Q1.1
  Bottom 0.254: v30.3,32 30.3,33.8 32,35.5 Q1.1
XTAL2
  Top 0.254: U1.8 26.6,26.9 26.6,29.9 25.3,31.2 25.3,31.9 C1.2 25.3,32 27.2,33.9 27.2,35.5 Q1.2

### Text on the board
tPlace: + | gr | + | blk | - | + | - | - | -
bPlace: - | - | blk | gr | Numitron Mini! 2012 | Adam Mayer, Raphael Abrams, John Dimatos